# Altium project PCB_FVT_TESTER.PrjPcb
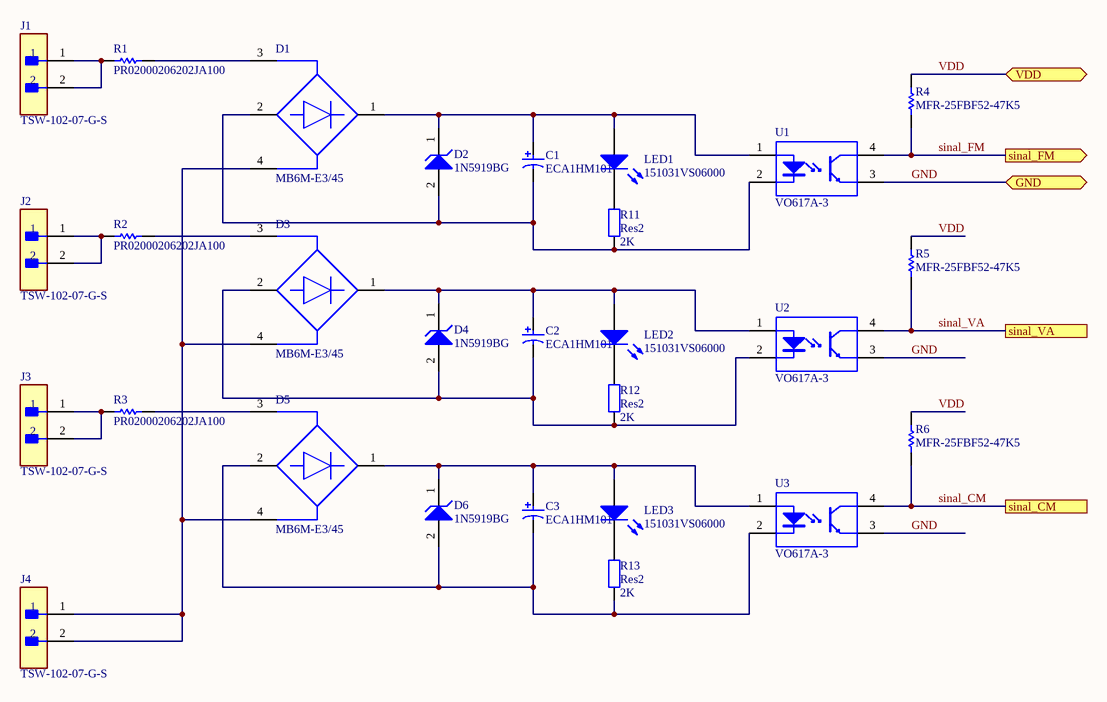
[diagram p0: Modulo de isolação AC.SchDoc]
3 sheets, 53 parts. Net scope: flat (ports and power ports of the same name join across sheets).
Board files: PCB_FVT_TESTER_2LAYERS.PcbDoc, PCB_FVT_TESTER.PcbDoc
Sheets:
  Modulo de isolação AC.SchDoc
  AdaptadorBateria.SchDoc
  soqueteESP32.SchDoc

## Sheet Modulo de isolação AC.SchDoc
size A4; Author: Nelson Seixas; SheetNumber: 1; SheetTotal: 3

### Parts
C1  ECA1HM101  [CAPPR65-350-1150X800X1250]
C2  ECA1HM101  [CAPPR65-350-1150X800X1250]
C3  ECA1HM101  [CAPPR65-350-1150X800X1250]
D1  MB6M-E3/45  [FP-MB6M-E3-45-MFG]
D2  1N5919BG  [ONSC-AXIAL_LEAD-2-59-10_P]
D3  MB6M-E3/45  [FP-MB6M-E3-45-MFG]
D4  1N5919BG  [ONSC-AXIAL_LEAD-2-59-10_P]
D5  MB6M-E3/45  [FP-MB6M-E3-45-MFG]
D6  1N5919BG  [ONSC-AXIAL_LEAD-2-59-10_P]
J1  TSW-102-07-G-S  [FP-TSW-102-07-G-S-MFG]
J2  TSW-102-07-G-S  [FP-TSW-102-07-G-S-MFG]
J3  TSW-102-07-G-S  [FP-TSW-102-07-G-S-MFG]
J4  TSW-102-07-G-S  [FP-TSW-102-07-G-S-MFG]
LED1  151031VS06000  [Type 3mm]
LED2  151031VS06000  [Type 3mm]
LED3  151031VS06000  [Type 3mm]
R1  PR02000206202JA100  [VISH-A1-2_V2]
R2  PR02000206202JA100  [VISH-A1-2_V2]
R3  PR02000206202JA100  [VISH-A1-2_V2]
R4  MFR-25FBF52-47K5  [RESA60-630X240]
R5  MFR-25FBF52-47K5  [RESA60-630X240]
R6  MFR-25FBF52-47K5  [RESA60-630X240]
R11  Res2  value 2K  [AXIAL-0.4]
R12  Res2  value 2K  [AXIAL-0.4]
R13  Res2  value 2K  [AXIAL-0.4]
U1  VO617A-3  [VISH-DIP-4]
U2  VO617A-3  [VISH-DIP-4]
U3  VO617A-3  [VISH-DIP-4]

### Ports
GND (bidir), sinal_CM, sinal_FM (out), sinal_VA, VDD (bidir)

### Nets
GND: U1.3(EMITTER) U2.3(EMITTER) U3.3(EMITTER) ; port GND
sinal_CM: R6.1 U3.4(COLLECTOR) ; port sinal_CM
sinal_FM: R4.1 U1.4(COLLECTOR) ; port sinal_FM
sinal_VA: R5.1 U2.4(COLLECTOR) ; port sinal_VA
VDD: R4.2 R5.2 R6.2 ; port VDD
NetC1_1: C1.1 D1.1(+) D2.1(K) LED1.2(A) U1.1(ANODE)
NetC1_2: C1.2 D1.2(-) D2.2(A) R11.1 U1.2(CATHODE)
NetC2_1: C2.1 D3.1(+) D4.1(K) LED2.2(A) U2.1(ANODE)
NetC2_2: C2.2 D3.2(-) D4.2(A) R12.1 U2.2(CATHODE)
NetC3_1: C3.1 D5.1(+) D6.1(K) LED3.2(A) U3.1(ANODE)
NetC3_2: C3.2 D5.2(-) D6.2(A) R13.1 U3.2(CATHODE)
NetD1_3: D1.3(1_~) R1.2
NetD1_4: D1.4(2_~) D3.4(2_~) D5.4(2_~) J4.1 J4.2
NetD3_3: D3.3(1_~) R2.2
NetD5_3: D5.3(1_~) R3.2
NetJ1_1: J1.1 J1.2 R1.1
NetJ2_1: J2.1 J2.2 R2.1
NetJ3_1: J3.1 J3.2 R3.1
NetLED1_1: LED1.1(K) R11.2
NetLED2_1: LED2.1(K) R12.2
NetLED3_1: LED3.1(K) R13.2

### Library data of the parts
C1-C3 = CMP-1665-00042-2: Aluminum Electrolytic Capacitor, 100 uF, +/- 20%, 50 V, -40 to 85 degC, 2-Pin THD, RoHS, Bulk; Manufacturer: Panasonic; Lead Diameter: 0.6mm; Dielectric Material: Aluminium; Voltage Rating (DC): 50V; Ripple Current (AC): 250mA; Polarity: Polar; Leakage Current: 3uA; Capacitance: 100uF; Life (Hours): 2000Hour; Lead/Base Style: Straight; Dissipation Factor: 0.12%; Radiation Hardening: No; Height: 11.5mm; Package Quantity: 200; Package Reference: CAPPR65-350-1150X800X1250; Min Operating Temperature: -40degC; Mount: ThroughHole; Package Description: 2-Pin Radial Lead, Dia 8 mm, Height 12.5 mm; Case/Package: Radial; Diameter: 8mm; Voltage Rating: 50V; Length: 11.5mm; REACH SVHC: NoSVHC; Height - Seated (Max): 0.492inch; Datasheet URL: https://industrial.panasonic.com/cdbs/www-data/pdf/RDF0000/ABA0000C1218.pdf; RoHSCompliant: true; Ripple Current: 250mA; Lead Free: LeadFree; Voltage: 50V; Manufacturer URL: http://www.panasonic.com/; Number of Pins: 2; Datasheet Version: Rev. 05, 10/2016; Packaging: Bulk; Termination: Radial; Max Operating Temperature: 85degC; Tolerance: 20%; Lead Pitch: 3.5mm
D1 D3 D5 = CMP-02540-000050-1: BRIDGE RECT 1P 600V 500MA MBM; Max Reverse Leakage Current: 5uA; Forward Current: 800mA; Element Configuration: Single; Forward Voltage: 1V; Peak Non-Repetitive Surge Current: 35A; Number of Elements: 1; Reverse Recovery Time: 150ns; Radiation Hardening: No; Package Quantity: 100; Height: 2.7mm; Max Repetitive Reverse Voltage (Vrrm): 600V; Packaging: Rail/Tube; Mount: Surface Mount; Peak Reverse Current: 5uA; Max Surge Current: 35A; Width: 4.1mm; Min Operating Temperature: -55°C; Case/Package: DIP; Length: 4.83mm; Max Operating Temperature: 150°C; Number of Pins: 4
D2 D4 D6 = CMP-1060-00030-1: 3 W Zener Voltage Regulator, 2-Pin Axial_Lead, Pb-Free, Bulk Box; Manufacturer: On Semiconductor; VZ Typ (V): 5.6; ComponentLink2URL: http://www.onsemi.cn/pub_link/Collateral/1N5913B-D.PDF; PackageDescription: 2-Pin, Axial Lead, Diameter 2.35 mm; Packing: Bulk Box; ComponentLink2Description: Datasheet; ComponentLink3URL: http://www.onsemi.cn/pub_link/Collateral/59-10.PDF; ComponentLink1URL: http://www.onsemi.com/; PartNumber: 1N5919BG; PackageVersion: Rev. U, 02/2005; RoHS: Pb-Free; ComponentLink3Description: Package Specification; DatasheetVersion: Rev. 5; ComponentLink1Description: Manufacturer URL; PackageReference: AXIAL_LEAD-2-59-10; Mounting Technology: Through Hole
J1-J4 = CMP-02766-000084-1: CONN HEADER VERT 2POS 2.54MM; Manufacturer: Samtec; Number Of Contacts: 2; Voltage Rating: 550V; Conn Orientation: Straight; Current Rating: 6.3A; Conn Gender: Male; Package: TSW-102-07-G-S; Digikey Description: CONN HEADER VERT 2POS 2.54MM; ComponentLink2URL: http://suddendocs.samtec.com/catalog_english/tsw_th.pdf; Height: 8.71mm; Temperature: -55°C to +125°C; Device Class L2: Headers and Wire Housings; ComponentLink2Description: Datasheet; Device Class L3: unset; Contact Material: Gold,Nickel; Temperature Range Low: -55°C; Temperature Range High: +125°C; RoHS: TRUE; Device Class L1: Connectors; Mouser Description: Conn Unshrouded Header HDR 2 POS 2.54mm Solder ST Thru-Hole Automotive Bulk; Number Of Rows: 1; Category: Conn; Pitch: 2.54mm; Lead Free: Yes; Automotive: No; Manufacturer Part Number: TSW-102-07-G-S; Footprint Url: http://suddendocs.samtec.com/prints/tsw-xxx-xx-x-x-xx-xxx-footprint.pdf; Octopart: https://octopart.com/tsw-102-07-g-s-samtec-272197
LED1-LED3 = CMP-1488-00004-1: THT LED round mono-color color lens, WL-TMRC , Bright Green; Manufacturer: Wuerth Elektronik; ComponentLink2Description: Datasheet; ComponentLink1URL: http://www.we-online.com; PartNumber: 151031VS06000; ComponentLink2URL: http://katalog.we-online.de/pbs/datasheet/7448042001.pdfhttp://katalog.we-online.de/pbs/datasheet/7448042001.pdfhttp://katalog.we-online.de/pbs/datasheet/7448042001.pdfhttp://katalog.we-online.de/pbs/datasheet/151031VS06000.pdf; ComponentLink1Description: Manufacturer URL; Emitting color: Bright Green; PackageReference: Type 3mm
R1-R3 = CMP-1240-00001-1: Power Metal Film Leaded Resistor, 62 KOhm +/-5%, 2 W, 2-Pin THD, RoHS, Ammo Pack; Manufacturer: Vishay Semiconductor; Resistance: 62 KOhm; Temperature Coefficient: +/-250 ppm/degC; Power: 2 W; ComponentLink2URL: http://www.vishay.com/docs/28729/28729.pdf; Mounting Technology: Through Hole; Tolerance: +/-5%; ComponentLink3Description: Package Specification; ComponentLink3URL: http://www.vishay.com/docs/28729/28729.pdf; ComponentLink1Description: Manufacturer URL; PartNumber: PR02000206202JA100; ComponentLink2Description: Datasheet; DatasheetVersion: Jun-13; PackageDescription: 2-Pin Axial Lead, Body 10 x 3.9 mm; ComponentLink1URL: http://www.vishay.com/; Packing: Ammo Pack; RoHS: TRUE
R4-R6 = CMP-1659-00063-1: Axial Resistor, 47.5 KOhm, +/- 1%, 0.25 W, -55 to 155 degC, 2-Pin THD, RoHS, Bulk; Tolerance: 20%; Shielding: Shielded; Current Rating: 1.3 A; Case\Package: 1008; ComponentLink1Description: Manufacturer URL; Packaging: Tape and Reel; ComponentLink2Description: Datasheet; Radiation Hardening: No; ComponentLink2URL: http://www.yageo.com/documents/recent/Yageo%20LR_MFR_2013.pdf; Min Operating Temperature: -55 degC; Mount: Surface Mount; Width: 2 mm; Length: 2.5 mm; Max Operating Temperature: 125 degC; PackageReference: MFR-25; Height: 1.2 mm; ComponentLink1URL: http://www.yageo.com/; DatasheetVersion: Apr-13; RoHSCompliant: true; Package Quantity: 3000; Case Code (Metric): 2520; PackageDescription: 2-Pin Axial Lead, Dia 2.4 mm, Body Length 6.3 mm
R11-R13 = Res2: Resistor; Published: 8-Jun-2000; LatestRevisionDate: 17-Jul-2002; LatestRevisionNote: Re-released for DXP Platform.; PackageReference: AXIAL-0.4; Publisher: Altium Limited; PackageDescription: Axial Device, Thru-Hole; 2 Leads; 0.4 in Pin Spacing
U1-U3 = CMP-2000-07400-1: Optocoupler, Phototransistor Output, High Reliability, 5300 VRMS, -55 to 110 degC, 4-Pin DIP, RoHS, Tape and Reel; Manufacturer: Vishay/Semiconductor; Maximum Current Transfer Ratio @ Current: 200%; Maximum Input Current: 60mA; Maximum Collector Current: 50mA; Maximum Collector Emitter Voltage: 80V; Output Type: DC; Typical Forward Voltage: 1.35V; Rad Hard: No; Maximum Reverse Voltage: 6V; Minimum Forward Voltage: 1V; Maximum Forward Voltage: 1.65V; Number of Channels per Chip: 1; Minimum Isolation Voltage: 5000Vrms; Maximum Collector Emitter Saturation Voltage: 400mV; Maximum Power Dissipation: 150mW; Mounting Technology: ThroughHole; Packaging: Tape&Reel; Package Reference: DIP-4; Datasheet URL: http://www.vishay.com/docs/83430/vo617a.pdf; Package: 4PDIP; Input Type: DC; Package Description: 4-Pin Double In-line Package, Body 4.58 x 6.5 mm, Pitch 2.54 mm; Manufacturer URL: http://www.vishay.com/; Operating Temperature: -55to110°C; Category: TransistorandPhotovoltaicOutputPhotoCouplers; Datasheet Version: Rev. 2.5, 08/2015

## Sheet AdaptadorBateria.SchDoc
size A4; SheetNumber: 2; SheetTotal: 3
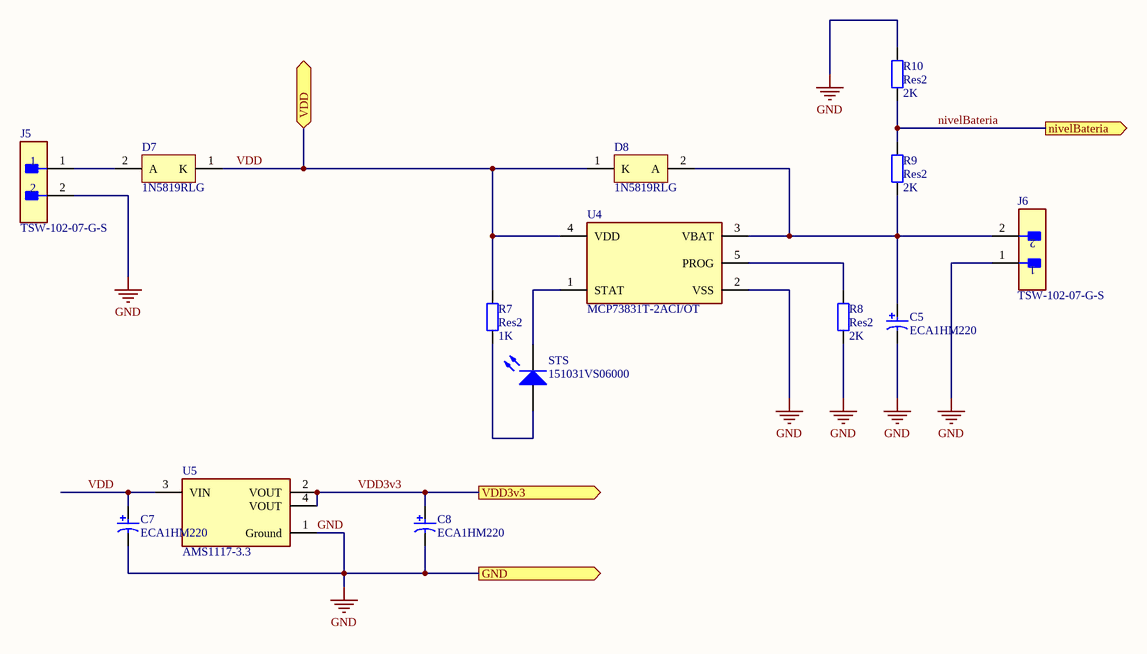
[diagram p1: AdaptadorBateria.SchDoc]

### Parts
C5  ECA1HM220  [CAPPR55-200-1100X500X1200]
C7  ECA1HM220  [CAPPR55-200-1100X500X1200]
C8  ECA1HM220  [CAPPR55-200-1100X500X1200]
D7  1N5819RLG  [ONSC-AXIAL_LEAD-2-59-10_P]
D8  1N5819RLG  [ONSC-AXIAL_LEAD-2-59-10_P]
J5  TSW-102-07-G-S  [FP-TSW-102-07-G-S-MFG]
J6  TSW-102-07-G-S  [FP-TSW-102-07-G-S-MFG]
R7  Res2  value 1K  [AXIAL-0.4]
R8  Res2  value 2K  [AXIAL-0.4]
R9  Res2  value 2K  [AXIAL-0.4]
R10  Res2  value 2K  [AXIAL-0.4]
STS  151031VS06000  [Type 3mm]
U4  MCP73831T-2ACI/OT  [FP-C04-091-OT-IPC_B]
U5  AMS1117-3.3  [FP-AMS1117-IPC_C]

### Ports
GND (out), nivelBateria (out), VDD3v3 (out), VDD (bidir)

### Nets
GND: C5.2 C7.2 C8.2 J5.2 J6.1 R8.1 R10.2 U4.2(VSS) U5.1(Ground) ; port GND
nivelBateria: R9.2 R10.1 ; port nivelBateria  [project net IO2]
VDD: C7.1 D7.1(K) D8.1(K) R7.2 U4.4(VDD) U5.3(VIN) ; port VDD
VDD3v3: C8.1 U5.2(VOUT) U5.4(VOUT) ; port VDD3v3
NetC5_1: C5.1 D8.2(A) J6.2 R9.1 U4.3(VBAT)
NetD7_2: D7.2(A) J5.1
NetR7_1: R7.1 STS.2(A)
NetR8_2: R8.2 U4.5(PROG)
NetSTS_1: STS.1(K) U4.1(STAT)

### Library data of the parts
C5 C7 C8 = CMP-1665-00036-2: Aluminum Electrolytic Capacitor, 22 uF, +/- 20%, 50 V, -40 to 85 degC, 2-Pin THD, RoHS, Bulk; Manufacturer: Panasonic; Ripple Current: 100mA; Life (Hours): 2000Hour; Voltage: 50V; Dissipation Factor: 0.12%; Leakage Current: 3uA; Lead/Base Style: Straight; Capacitance: 22uF; Lead Diameter: 0.5mm; Max Operating Temperature: 85degC; Height: 11mm; Package Reference: CAPPR55-200-1100X500X1200; Radiation Hardening: No; RoHSCompliant: true; Termination: Radial; Case/Package: Radial; REACH SVHC: NoSVHC; Height - Seated (Max): 0.472inch; Min Operating Temperature: -40degC; Packaging: Bulk; Manufacturer URL: http://www.panasonic.com/; Length: 11mm; Tolerance: 20%; Voltage Rating: 50V; Voltage Rating (DC): 50V; Datasheet URL: https://industrial.panasonic.com/cdbs/www-data/pdf/RDF0000/ABA0000C1218.pdf; Lead Pitch: 2mm; Ripple Current (AC): 100mA; Package Description: 2-Pin Radial Lead, Dia 5 mm, Height 12 mm; Diameter: 5mm; Datasheet Version: Rev. 05, 10/2016; Package Quantity: 200; Mount: ThroughHole
D7 D8 = CMP-1055-00037-1: Rectifier, 2-Pin Axial_Lead, Pb-Free, Tape and Reel; Manufacturer: On Semiconductor; IFSM Max (A): 25; Configuration: Single; ComponentLink1Description: Manufacturer URL; PackageReference: AXIAL_LEAD-2-59-10; RoHS: TRUE; PackageVersion: Rev. U, 02/2005; Mounting Technology: Through Hole; ComponentLink3URL: http://www.onsemi.cn/pub_link/Collateral/59-10.PDF; ComponentLink3Description: Package Specification; PackageDescription: 2-Pin, Axial Lead, Diameter 2.35 mm; ComponentLink2Description: Datasheet; ComponentLink1URL: http://www.onsemi.com/; Packing: Tape and Reel; DatasheetVersion: Rev. 10; ComponentLink2URL: http://www.onsemi.cn/pub_link/Collateral/1N5817-D.PDF; PartNumber: 1N5819RLG
J5 J6 = CMP-02766-000084-1: as J1 on sheet Modulo de isolação AC; Package: TSW-102-07-G-S; Digikey Description: CONN HEADER VERT 2POS 2.54MM; ComponentLink2URL: http://suddendocs.samtec.com/catalog_english/tsw_th.pdf; Height: 8.71mm; Temperature: -55°C to +125°C; Device Class L2: Headers and Wire Housings; ComponentLink2Description: Datasheet; Device Class L3: unset; Contact Material: Gold,Nickel; Temperature Range Low: -55°C; Temperature Range High: +125°C; RoHS: TRUE; Device Class L1: Connectors; Mouser Description: Conn Unshrouded Header HDR 2 POS 2.54mm Solder ST Thru-Hole Automotive Bulk; Number Of Rows: 1; Category: Conn; Pitch: 2.54mm; Lead Free: Yes; Automotive: No; Manufacturer Part Number: TSW-102-07-G-S; Footprint Url: http://suddendocs.samtec.com/prints/tsw-xxx-xx-x-x-xx-xxx-footprint.pdf; Octopart: https://octopart.com/tsw-102-07-g-s-samtec-272197
R7-R10 = Res2: Resistor; Published: 8-Jun-2000; LatestRevisionDate: 17-Jul-2002; LatestRevisionNote: Re-released for DXP Platform.; PackageReference: AXIAL-0.4; Publisher: Altium Limited; PackageDescription: Axial Device, Thru-Hole; 2 Leads; 0.4 in Pin Spacing
STS = CMP-1488-00004-1: as LED1 on sheet Modulo de isolação AC; ComponentLink2Description: Datasheet; ComponentLink1URL: http://www.we-online.com; PartNumber: 151031VS06000; ComponentLink2URL: http://katalog.we-online.de/pbs/datasheet/7448042001.pdfhttp://katalog.we-online.de/pbs/datasheet/7448042001.pdfhttp://katalog.we-online.de/pbs/datasheet/7448042001.pdfhttp://katalog.we-online.de/pbs/datasheet/151031VS06000.pdf; ComponentLink1Description: Manufacturer URL; Emitting color: Bright Green; PackageReference: Type 3mm
U4 = CMP-0133-00143-2: IC CONTROLLR LI-ION 4.2V SOT23-5; Max Power Dissipation: 1.54W; Output Current: 500mA; Max Output Voltage: 4.5V; Number of Outputs: 1; Min Output Voltage: 4.168V; Min Supply Voltage: 3.75V; Max Input Voltage: 6V; Voltage Rating: 4.534V; Drain to Source Resistance: 350mR; Max Operating Temperature: 85°C; Length: 0.122inch; Number of Pins: 5; REACH SVHC: No SVHC; Radiation Hardening: No; Min Operating Temperature: -40°C; Weight: 0.00709oz; Contact Plating: Tin; Termination: SMD/SMT; Case/Package: SOT-23; Mount: Surface Mount; Width: 0.071inch; Packaging: Tape and Reel; Number of Cells: 1; Max Charge Current: 500mA; Height: 0.051inch; Number of Channels: 1; Output Voltage: 4.2V; Max Supply Voltage: 6V; Lead Free: Lead Free
U5 = CMP-209535-000001-1: LDO Voltage Regulators 1A, 3.3V; Manufacturer: Advanced Monolithic Systems; Dropout Voltage: 1.1V; Output Type: Fixed; Nominal Supply Current: 5mA; Max Power Dissipation: 1.2W; Max Supply Voltage: 15V; Number Of Outputs: 1; Standoff Height: 0.64mm; Max Junction Temp: +125°C; Height: 1.8mm; Package: AMS1117; Device Class L2: Power Management ICs; ComponentLink2Description: Datasheet; ComponentLink2URL: http://www.advanced-monolithic.com/pdf/ds1117.pdf; Category: IC; RoHS: TRUE; Automotive: No; Device Class L1: Integrated Circuits (ICs); Output Current: 1A; Device Class L3: Voltage Regulators - Linear; Temperature: -40°C to +125°C; Output Voltage: 3.3V; Manufacturer Part Number: AMS1117-3.3; Temperature Range Low: -40°C; Octopart: https://octopart.com/ams1117-3.3-advanced+monolithic+systems-25899300; Lead Free: Yes; Ipc Land Pattern Name: SOT229P700X180-4; Temperature Range High: +125°C

## Sheet soqueteESP32.SchDoc
size A4; SheetNumber: 3; SheetTotal: 3
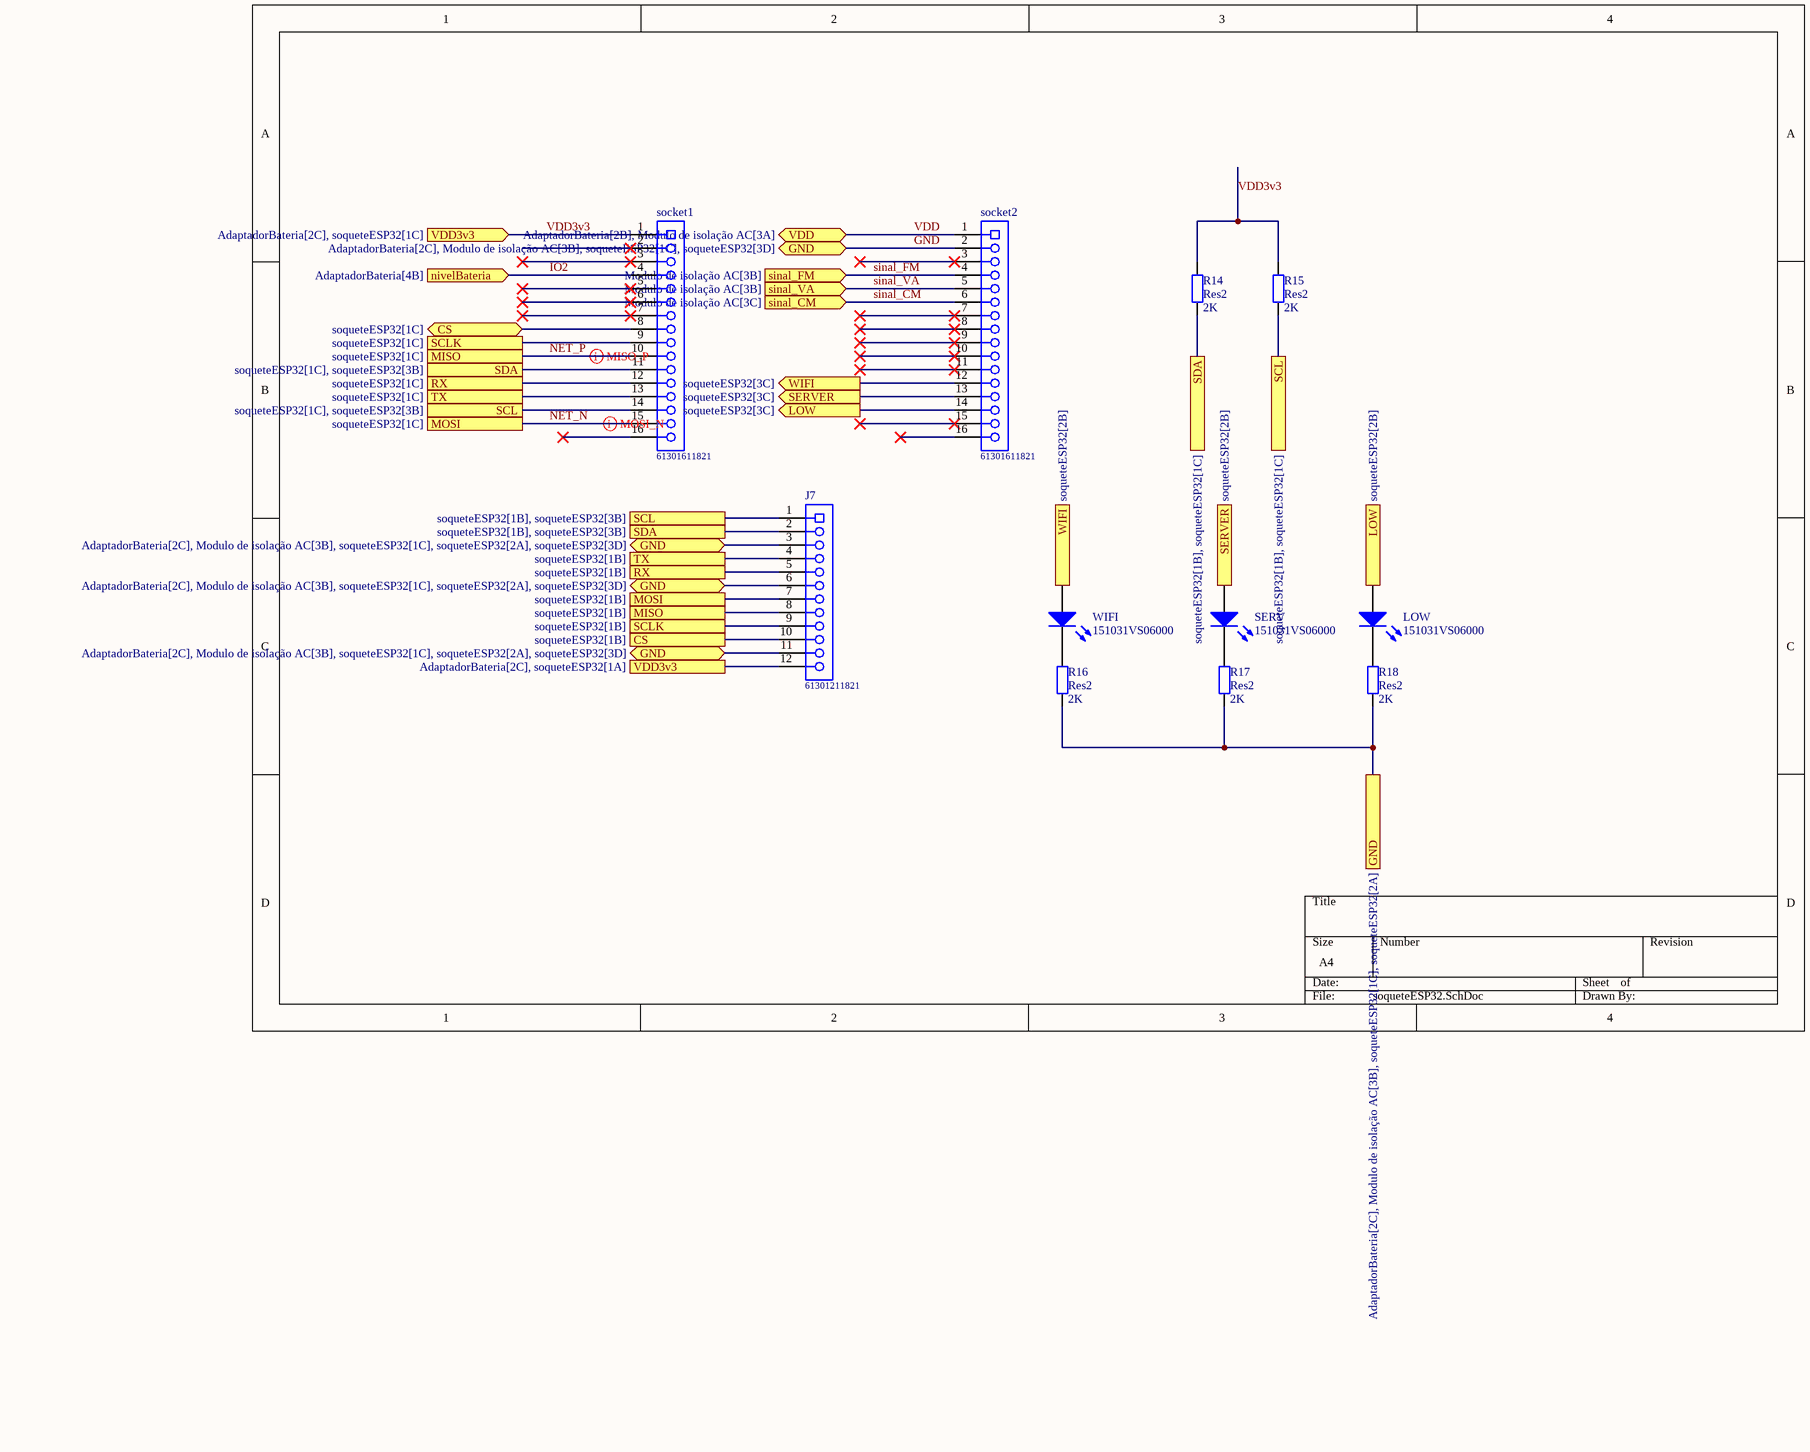
[diagram p2: soqueteESP32.SchDoc]

### Parts
J7  61301211821  [61301211821]
LOW  151031VS06000  [Type 3mm]
R14  Res2  value 2K  [AXIAL-0.4]
R15  Res2  value 2K  [AXIAL-0.4]
R16  Res2  value 2K  [AXIAL-0.4]
R17  Res2  value 2K  [AXIAL-0.4]
R18  Res2  value 2K  [AXIAL-0.4]
SERV  151031VS06000  [Type 3mm]
socket1  61301611821  [61301611821]
socket2  61301611821  [61301611821]
WIFI  151031VS06000  [Type 3mm]

### Ports
CS (bidir, see soqueteESP32[1C]), CS (see soqueteESP32[1B]), GND (bidir, see AdaptadorBateria[2C], Modulo de isolação AC[3B], soqueteESP32[1C], soqueteESP32[2A], soqueteESP32[3D]), GND (bidir, see AdaptadorBateria[2C], Modulo de isolação AC[3B], soqueteESP32[1C], soqueteESP32[3D]), GND (see AdaptadorBateria[2C], Modulo de isolação AC[3B], soqueteESP32[1C], soqueteESP32[2A]), LOW (in, see soqueteESP32[2B]), LOW (out, see soqueteESP32[3C]), MISO (see soqueteESP32[1B]), MISO (see soqueteESP32[1C]), MOSI (see soqueteESP32[1B]), MOSI (see soqueteESP32[1C]), nivelBateria (in, see AdaptadorBateria[4B]), RX (see soqueteESP32[1B]), RX (see soqueteESP32[1C]), SCL (see soqueteESP32[1B], soqueteESP32[1C]), SCL (see soqueteESP32[1B], soqueteESP32[3B]), SCL (see soqueteESP32[1C], soqueteESP32[3B]), SCLK (see soqueteESP32[1B]), SCLK (see soqueteESP32[1C]), SDA (see soqueteESP32[1B], soqueteESP32[1C]), SDA (see soqueteESP32[1B], soqueteESP32[3B]), SDA (see soqueteESP32[1C], soqueteESP32[3B]), SERVER (in, see soqueteESP32[2B]), SERVER (out, see soqueteESP32[3C]), sinal_CM (in, see Modulo de isolação AC[3C]), sinal_FM (in, see Modulo de isolação AC[3B]), sinal_VA (in, see Modulo de isolação AC[3B]), TX (see soqueteESP32[1B]), TX (see soqueteESP32[1C]), VDD3v3 (in, see AdaptadorBateria[2C], soqueteESP32[1C]), VDD3v3 (see AdaptadorBateria[2C], soqueteESP32[1A]), VDD (bidir, see AdaptadorBateria[2B], Modulo de isolação AC[3A]), WIFI (in, see soqueteESP32[2B]), WIFI (out, see soqueteESP32[3C])

### Nets
GND: J7.3 J7.6 J7.11 R16.1 R17.1 R18.1 socket2.2 ; port GND
IO2: socket1.4 ; port nivelBateria
NET_N: J7.7 socket1.15 ; port MOSI
NET_P: J7.8 socket1.10 ; port MISO
sinal_CM: socket2.6 ; port sinal_CM
sinal_FM: socket2.4 ; port sinal_FM
sinal_VA: socket2.5 ; port sinal_VA
VDD: socket2.1 ; port VDD
VDD3v3: J7.12 R14.2 R15.2 socket1.1 ; port VDD3v3
NetJ7_1: J7.1 R15.1 socket1.14 ; port SCL
NetJ7_2: J7.2 R14.1 socket1.11 ; port SDA
NetJ7_4: J7.4 socket1.13 ; port TX
NetJ7_5: J7.5 socket1.12 ; port RX
NetJ7_9: J7.9 socket1.9 ; port SCLK
NetJ7_10: J7.10 socket1.8 ; port CS
NetLOW_1: LOW.1(K) R18.2
NetLOW_2: LOW.2(A) socket2.14 ; port LOW
NetR16_2: R16.2 WIFI.1(K)
NetR17_2: R17.2 SERV.1(K)
NetSERV_2: SERV.2(A) socket2.13 ; port SERVER
Netsocket2_12: socket2.12 WIFI.2(A) ; port WIFI

Not connected (* = marked no-connect by the designer): socket1 2* 3* 5* 6* 7* 16*; socket2 3* 7* 8* 9* 10* 11* 15* 16*

### Layout directives
differential pair: NET_N, NET_P

### Library data of the parts
J7 = CMP-1502-01337-1: THT Vertical Socket Header WR-PHD, Pitch 2.54 mm, Single Row, 12 pins; Manufacturer: Wurth Elektronik; Gender: Female; Pin Number: 12; Withstanding Voltage: 500VAC; Working Voltage: 250VAC; Rated Current: 3A; Contact Resistance: 20mOhm; Pitch: 2.54mm; Package Reference: 61301211821; Manufacturer URL: http://www.we-online.de; Datasheet URL: https://katalog.we-online.de/em/datasheet/6130xx11821.pdf; Publisher: WurthElektronik; Orientation: Vertical; Mounting Technology: THT; Operating Temperature: -40to125degC; Part Number: 61301211821; Packaging: Tray; Row Number: Single
LOW SERV WIFI = CMP-1488-00004-1: as LED1 on sheet Modulo de isolação AC; ComponentLink2Description: Datasheet; ComponentLink1URL: http://www.we-online.com; PartNumber: 151031VS06000; ComponentLink2URL: http://katalog.we-online.de/pbs/datasheet/7448042001.pdfhttp://katalog.we-online.de/pbs/datasheet/7448042001.pdfhttp://katalog.we-online.de/pbs/datasheet/7448042001.pdfhttp://katalog.we-online.de/pbs/datasheet/151031VS06000.pdf; ComponentLink1Description: Manufacturer URL; Emitting color: Bright Green; PackageReference: Type 3mm
R14-R18 = Res2: Resistor; Published: 8-Jun-2000; LatestRevisionDate: 17-Jul-2002; LatestRevisionNote: Re-released for DXP Platform.; PackageReference: AXIAL-0.4; Publisher: Altium Limited; PackageDescription: Axial Device, Thru-Hole; 2 Leads; 0.4 in Pin Spacing
socket1 socket2 = CMP-1502-01343-1: THT Vertical Socket Header WR-PHD, Pitch 2.54 mm, Single Row, 16 pins; Manufacturer: Wurth Elektronik; Working Voltage: 250VAC; Pin Number: 16; Gender: Female; Withstanding Voltage: 500VAC; Rated Current: 3A; Contact Resistance: 20mOhm; Pitch: 2.54mm; Operating Temperature: -40to125degC; Manufacturer URL: http://www.we-online.de; Mounting Technology: THT; Part Number: 61301611821; Datasheet URL: https://katalog.we-online.de/em/datasheet/6130xx11821.pdf; Publisher: WurthElektronik; Row Number: Single; Orientation: Vertical; Packaging: Tray; Package Reference: 61301611821

## Nets that join several sheets
GND: Modulo de isolação AC (U1.3 U2.3 U3.3), AdaptadorBateria (9 pins), soqueteESP32 (7 pins)
IO2: AdaptadorBateria (R9.2 R10.1), soqueteESP32 (socket1.4)
sinal_CM: Modulo de isolação AC (R6.1 U3.4), soqueteESP32 (socket2.6)
sinal_FM: Modulo de isolação AC (R4.1 U1.4), soqueteESP32 (socket2.4)
sinal_VA: Modulo de isolação AC (R5.1 U2.4), soqueteESP32 (socket2.5)
VDD: Modulo de isolação AC (R4.2 R5.2 R6.2), AdaptadorBateria (6 pins), soqueteESP32 (socket2.1)
VDD3v3: AdaptadorBateria (C8.1 U5.2 U5.4), soqueteESP32 (J7.12 R14.2 R15.2 socket1.1)